# Altium schematic sheet Sheet.SchDoc
size A; SheetNumber: 1; SheetTotal: 1
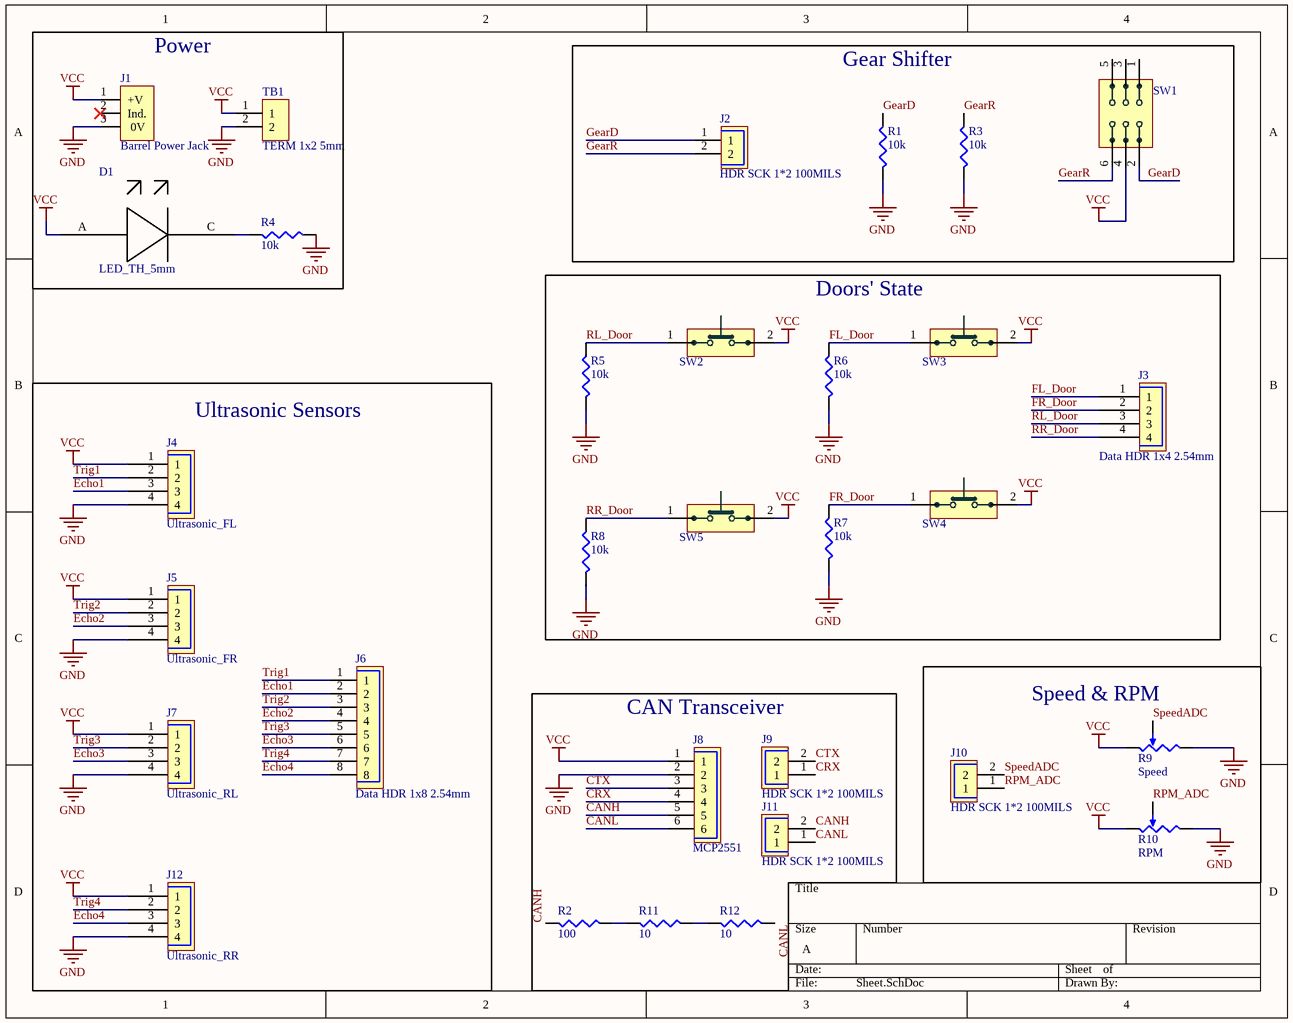
[diagram p0: Sheet.SchDoc]

## Parts
D1  LED_TH_5mm  [LED_TH_5mm]
J1  Barrel Power Jack  [pwr_Jack]
J2  HDR SCK 1*2 100MILS  [DHDR 1*2 2,54MM]
J3  Data HDR 1x4 2.54mm  [DHDR_1x4_2.54mm]
J4  Ultrasonic_FL  [DHDR_1x4_2.54mm]
J5  Ultrasonic_FR  [DHDR_1x4_2.54mm]
J6  Data HDR 1x8 2.54mm  [DHDR_1x8_2.54mm]
J7  Ultrasonic_RL  [DHDR_1x4_2.54mm]
J8  MCP2551  [DHDR_1x6_2.54mm]
J9  HDR SCK 1*2 100MILS  [DHDR 1*2 2,54MM]
J10  HDR SCK 1*2 100MILS  [DHDR 1*2 2,54MM]
J11  HDR SCK 1*2 100MILS  [DHDR 1*2 2,54MM]
J12  Ultrasonic_RR  [DHDR_1x4_2.54mm]
R1  10k  [R_THT_CFR-25]
R2  100  [R_THT_CFR-25]
R3  10k  [R_THT_CFR-25]
R4  10k  [R_THT_CFR-25]
R5  10k  [R_THT_CFR-25]
R6  10k  [R_THT_CFR-25]
R7  10k  [R_THT_CFR-25]
R8  10k  [R_THT_CFR-25]
R9  Speed  [POT]
R10  RPM  [POT]
R11  10  [R_THT_CFR-25]
R12  10  [R_THT_CFR-25]
SW1  1825910-6  [DPDT_6Pin]  (value not drawn)
SW2  1825910-6  [Push_Button_10mm_2Pin]  (value not drawn)
SW3  1825910-6  [Push_Button_10mm_2Pin]  (value not drawn)
SW4  1825910-6  [Push_Button_10mm_2Pin]  (value not drawn)
SW5  1825910-6  [Push_Button_10mm_2Pin]  (value not drawn)
TB1  TERM 1x2 5mm  [Terminal_5mm]

## Blocks framed on the sheet
Power: D1 J1 R4 TB1
Gear Shifter: J2 R1 R3 SW1
Doors' State: J3 R5-R8 SW2-SW5
Ultrasonic Sensors: J4-J7 J12
CAN Transceiver: J8 J9 J11 R2 R11 R12
Speed & RPM: J10 R9 R10

## Nets
GND: J1.3(0V) J4.4 J5.4 J7.4 J8.2 J12.4 R1.1 R3.1 R4.1 R5.1 R6.1 R7.1 R8.1 R9.2 R10.2 TB1.2
VCC: D1.A J1.1(+V) J4.1 J5.1 J7.1 J8.1 J12.1 R9.1 R10.1 SW1.4 SW2.2 SW3.2 SW4.2 SW5.2 TB1.1
CANH: J8.5 J11.2 R2.2
CANL: J8.6 J11.1 R12.1
CRX: J8.4 J9.1
CTX: J8.3 J9.2
Echo1: J4.3 J6.2
Echo2: J5.3 J6.4
Echo3: J6.6 J7.3
Echo4: J6.8 J12.3
FL_Door: J3.1 R6.2 SW3.1
FR_Door: J3.2 R7.2 SW4.1
GearD: J2.1 R1.2 SW1.2
GearR: J2.2 R3.2 SW1.6
RL_Door: J3.3 R5.2 SW2.1
RPM_ADC: J10.1 R10.3
RR_Door: J3.4 R8.2 SW5.1
SpeedADC: J10.2 R9.3
Trig1: J4.2 J6.1
Trig2: J5.2 J6.3
Trig3: J6.5 J7.2
Trig4: J6.7 J12.2
NetD1_C: D1.C R4.2
NetR2_1: R2.1 R11.2
NetR11_1: R11.1 R12.2

Not connected (* = marked no-connect by the designer): J1 2(Ind.)*; SW1 1 3 5

## Library data of the parts
J1 = Con-Jack: DC-Power Socket 12V 5A 2, 1mm Solder Eyel; Manufacturer 1: Cliff; Manufacturer Part Number 1: FC68148; Parameter Name 1: Bulk; Inside Diameter: 6.3mm; Supplier 1: Conrad; RoHS: Yes; Weight: 0.1lb; Current Rating: 5A; Orientation: Right Angle; Connector Type: Socket; Length: 5inch; Height: 0.25inch; Width: 3inch; ComponentLink1URL: http://www.farnell.com/datasheets/317160.pdf?src-supplier=Farnell; ComponentLink1Description: http://www.farnell.com/datasheets/317160.pdf?src-supplier=Farnell; ComponentLink2URL: http://www.rapidonline.com/pdf/735742_da_en_01.pdf?src-supplier=Rapid+Electronics; ComponentLink2Description: http://www.rapidonline.com/pdf/735742_da_en_01.pdf?src-supplier=Rapid+Electronics; ComponentLink3URL: http://www.produktinfo.conrad.com/datenblaetter/725000-749999/735742-da-01-en-DC_BUCHSE_2_1MM_FC68148.pdf?src-supplier=Conrad; ComponentLink3Description: http://www.produktinfo.conrad.com/datenblaetter/725000-749999/735742-da-01-en-DC_BUCHSE_2_1MM_FC68148.pdf?src-supplier=Conrad; Supplier Part Number 1: 735742
J2 J9-J11 = 2-Pin Data Connector: Conn Shrouded Header HDR 2 POS 2.54mm Solder ST Thru-Hole; Manufacturer 1: TE Connectivity; Manufacturer Part Number 1: 2-644861-2; Underplate Material: Nickel; Number of Contacts: 2; Connector Type: Plug,Header,Pin; Voltage Rating: 250V; Mating Alignment: Yes (With); PCB Mount Retention: Without; PCB Mounting Orientation: Vertical; Gender: Male; Current Rating: 5A; Contact Resistance: 6mR; Contact Retention: No (Without); Connector System: Wire-to-Board; Contact Style: Straight; Contact Post Length: 3.56mm; Plating Thickness: 6.3um; PCB Thickness: 0.063inch; Approvals: CSA; Supplier 1: Digi-Key; Stock 1: 3206; Pricing 1: 1=0.41000, 10=0.39200, 100=0.27420, 500=0.23506, 1000=0.19588, 5000=0.16790, 10000=0.15670 (USD); RoHS: Yes; Mount: Through Hole; Housing Color: Black; Contact Plating: Tin,Matte; Contact Material: Copper Alloy; Housing Material: Polyester; Color: Black; Contact Shape: Square; Min Operating Temperature: -67°C; Max Operating Temperature: 221°C; Termination: Solder; Number of Rows: 1; Number of Positions: 2; Package Quantity: 500; Packaging: Bag; Contact Gender: Male; Orientation: Straight; Fastening Type: Friction; Max Voltage Rating (AC): 250V; Shrouded: Yes (With); Voltage Rating (AC): 250V; Mating Retention: Yes (With); PCB Mount Alignment: No (Without); Sealable: No (Without); Contact Current Rating: 5A; Strain Relief: No (Without); Backwall/Post Interruptions: No (Without); Length: 7.21mm; Height: 10.41mm; Pitch: 2.54mm; Contact Mating Length: 5.1mm; Depth: 7.95mm; Tail Length: 3.56mm; Radiation Hardening: No; Flammability Rating: UL94 V-0; ELV: Compliant; Lead Free: Lead Free; REACH SVHC: Unknown; ComponentLink1URL: https://datasheet.ciiva.com/16303/eng-ds-82056-mta-0608-16303634.pdf?src-supplier=Future+Electronics; ComponentLink1Description: https://datasheet.ciiva.com/16303/eng-ds-82056-mta-0608-16303634.pdf?src-supplier=Future+Electronics; ComponentLink2URL: https://datasheet.ciiva.com/30111/8852eng-ds-82056-mta-0608-30111398.pdf?src-supplier=Onlinecomponents.com; ComponentLink2Description: https://datasheet.ciiva.com/30111/8852eng-ds-82056-mta-0608-30111398.pdf?src-supplier=Onlinecomponents.com; ComponentLink3URL: https://datasheet.ciiva.com/709/eng-cd-644861-n-basefilename-709739.pdf?src-supplier=Digi-Key; ComponentLink3Description: https://datasheet.ciiva.com/709/eng-cd-644861-n-basefilename-709739.pdf?src-supplier=Digi-Key; ComponentLink4URL: https://datasheet.ciiva.com/3118/eng-ds-82056-mta-0608-3118126.pdf?src-supplier=Avnet; ComponentLink4Description: https://datasheet.ciiva.com/3118/eng-ds-82056-mta-0608-3118126.pdf?src-supplier=Avnet; Supplier Part Number 1: A30931-ND
J3-J5 J7 J12 = 4-Pin Data Connector: MTA-100 Series, 2.54mm Pitch 4 Way 1 RowStraight PCB Header, Solder Term, 5A; Manufacturer 1: TE Connectivity; Manufacturer Part Number 1: 2-644861-4; Underplate Material: Nickel; Number of Contacts: 4; Connector Type: Plug,Header,Pin; Voltage Rating: 250V; Gender: Male; Shrouded: Yes (With); PCB Mount Retention: Without; PCB Mounting Orientation: Vertical; Contact Resistance: 6mR; Backwall/Post Interruptions: No (Without); Connector System: Wire-to-Board; Contact Post Length: 3.56mm; Plating Thickness: 6.35um; PCB Thickness: 0.063inch; Approvals: CSA; Supplier 1: Digi-Key; Stock 1: 18767; Pricing 1: 1=0.79000, 10=0.74100, 100=0.56790, 500=0.49380, 1000=0.40739, 5000=0.35801, 10000=0.33332 (USD); RoHS: Yes; Mount: Through Hole; Housing Color: Black; Color: Black; Contact Material: Copper Alloy; Contact Plating: Tin,Matte; Housing Material: Polyester; Contact Shape: Square; Min Operating Temperature: -67°C; Max Operating Temperature: 221°C; Termination: Solder; Number of Rows: 1; Contact Gender: Male; Number of Positions: 4; Package Quantity: 500; Packaging: Loose Piece; Current Rating: 5A; Voltage Rating (AC): 250V; Mating Alignment: Yes (With); Orientation: Straight; Fastening Type: Friction; Max Voltage Rating (AC): 250V; Contact Current Rating: 5A; Contact Retention: No (Without); Mating Retention: Yes (With); PCB Mount Alignment: No (Without); Sealable: No (Without); Strain Relief: No (Without); Contact Style: Straight; Length: 12.29mm; Height: 10.41mm; Pitch: 2.54mm; Contact Mating Length: 5.1mm; Depth: 7.95mm; Tail Length: 3.56mm; Radiation Hardening: No; Flammability Rating: UL94 V-0; ELV: Compliant; Lead Free: Lead Free; REACH SVHC: Unknown; ComponentLink1URL: https://datasheet.ciiva.com/7800/1651878-7800290.pdf?src-supplier=Element14; ComponentLink1Description: https://datasheet.ciiva.com/7800/1651878-7800290.pdf?src-supplier=Element14; ComponentLink2URL: https://datasheet.ciiva.com/15175/getdatasheetpartid-36841-15175492.pdf?src-supplier=Verical; ComponentLink2Description: https://datasheet.ciiva.com/15175/getdatasheetpartid-36841-15175492.pdf?src-supplier=Verical; ComponentLink3URL: https://datasheet.ciiva.com/11759/0900766b80f915a0-11759930.pdf?src-supplier=RSComponents; ComponentLink3Description: https://datasheet.ciiva.com/11759/0900766b80f915a0-11759930.pdf?src-supplier=RSComponents; ComponentLink4URL: https://datasheet.ciiva.com/714/eng-cd-644861-n-basefilename-714593.pdf?src-supplier=Digi-Key; ComponentLink4Description: https://datasheet.ciiva.com/714/eng-cd-644861-n-basefilename-714593.pdf?src-supplier=Digi-Key; ComponentLink5URL: https://datasheet.ciiva.com/16684/eng-ds-82056-mta-0608-16684709.pdf?src-supplier=Avnet+Europe; ComponentLink5Description: https://datasheet.ciiva.com/16684/eng-ds-82056-mta-0608-16684709.pdf?src-supplier=Avnet+Europe; ComponentLink6URL: https://datasheet.ciiva.com/16497/eng-ds-82056-mta-0608-16497871.pdf?src-supplier=Avnet+Asia; ComponentLink6Description: https://datasheet.ciiva.com/16497/eng-ds-82056-mta-0608-16497871.pdf?src-supplier=Avnet+Asia; Supplier Part Number 1: A30933-ND
J6 = PinHeader_8Pin: CONN HEADER VERT 8POS .100 TIN; Manufacturer 1: TE Connectivity; Manufacturer Part Number 1: 2-644861-8; Underplate Material: Nickel; Number of Contacts: 8; Connector Type: Plug,Header,Pin; Mating Alignment: Yes (With); PCB Mount Retention: Without; PCB Mounting Orientation: Vertical; Contact Resistance: 6mR; Max Voltage Rating (AC): 250V; Current Rating: 5A; Gender: Male; Backwall/Post Interruptions: No (Without); Connector System: Wire-to-Board; Contact Style: Straight; Contact Post Length: 3.56mm; Plating Thickness: 6.3um; PCB Thickness: 0.063inch; Approvals: CSA; Supplier 1: Digi-Key; Stock 1: 1996; Pricing 1: 1=0.62000, 10=0.58100, 100=0.44530, 500=0.38726, 1000=0.31949, 5000=0.28076, 10000=0.26140 (USD); RoHS: Yes; Mount: Through Hole; Housing Material: Polyester; Contact Shape: Square; Contact Plating: Tin,Matte; Contact Material: Copper Alloy; Color: Black; Housing Color: Black; Min Operating Temperature: -67°C; Max Operating Temperature: 221°C; Termination: Solder; Number of Rows: 1; Number of Positions: 8; Packaging: Bulk; Contact Gender: Male; Package Quantity: 1000; Voltage Rating: 250V; Fastening Type: Friction; Orientation: Straight; Contact Retention: No (Without); Mating Retention: Yes (With); PCB Mount Alignment: No (Without); Sealable: No (Without); Strain Relief: No (Without); Contact Current Rating: 5A; Length: 22.45mm; Height: 10.41mm; Pitch: 2.54mm; Contact Mating Length: 5.1mm; Depth: 7.95mm; Tail Length: 3.56mm; Radiation Hardening: No; Flammability Rating: UL94 V-0; REACH SVHC: Unknown; ComponentLink1URL: https://datasheet.ciiva.com/16303/2-644861-8-16303640.pdf?src-supplier=Future+Electronics; ComponentLink1Description: https://datasheet.ciiva.com/16303/2-644861-8-16303640.pdf?src-supplier=Future+Electronics; ComponentLink2URL: https://datasheet.ciiva.com/11745/0900766b81026688-11745886.pdf?src-supplier=RSComponents; ComponentLink2Description: https://datasheet.ciiva.com/11745/0900766b81026688-11745886.pdf?src-supplier=RSComponents; ComponentLink3URL: https://datasheet.ciiva.com/709/eng-cd-644861-n-basefilename-709773.pdf?src-supplier=Digi-Key; ComponentLink3Description: https://datasheet.ciiva.com/709/eng-cd-644861-n-basefilename-709773.pdf?src-supplier=Digi-Key; ComponentLink4URL: https://datasheet.ciiva.com/9478/eng-ds-82056-mta-0608-9478367.pdf?src-supplier=Avnet; ComponentLink4Description: https://datasheet.ciiva.com/9478/eng-ds-82056-mta-0608-9478367.pdf?src-supplier=Avnet; ComponentLink5URL: https://datasheet.ciiva.com/16684/eng-ds-82056-mta-0608-16684159.pdf?src-supplier=Avnet+Europe; ComponentLink5Description: https://datasheet.ciiva.com/16684/eng-ds-82056-mta-0608-16684159.pdf?src-supplier=Avnet+Europe; Supplier Part Number 1: A30937-ND
J8 = 6-Pin Data Connector: CONN HEADER VERT 6POS .100 TIN; Manufacturer 1: TE Connectivity; Manufacturer Part Number 1: 2-644861-6; Underplate Material: Nickel; Number of Contacts: 6; Connector Type: Plug,Header,Pin; Contact Resistance: 6mR; Mating Alignment: Yes (With); PCB Mount Retention: Without; PCB Mounting Orientation: Vertical; Parameter Name 1: Box; Voltage Rating: 250V; Current Rating: 5A; Backwall/Post Interruptions: No (Without); Connector System: Wire-to-Board; Plating Thickness: 6.3um; Contact Style: Straight; Pitch: 2.54mm; Contact Post Length: 3.56mm; PCB Thickness: 0.063inch; Approvals: CSA; Supplier 1: Digi-Key; Stock 1: 208; Pricing 1: 1=1.04000, 10=0.91900, 100=0.79250, 500=0.64840, 1000=0.57635, 5000=0.50431, 10000=0.47909 (USD); RoHS: Yes; Mount: Through Hole; Housing Material: Polyester; Contact Plating: Tin,Matte; Contact Material: Copper Alloy; Contact Shape: Square; Color: Black; Housing Color: Black; Min Operating Temperature: -67°C; Max Operating Temperature: 221°C; Number of Rows: 1; Termination: Solder; Contact Gender: Male; Package Quantity: 1000; Max Voltage Rating (AC): 250V; Fastening Type: Friction; Orientation: Straight; Number of Positions: 6; Contact Retention: No (Without); Mating Retention: Yes (With); PCB Mount Alignment: No (Without); Sealable: No (Without); Strain Relief: No (Without); Contact Current Rating: 5A; Length: 0.684inch; Height: 10.41mm; Contact Mating Length: 5.1mm; Depth: 7.95mm; Tail Length: 3.56mm; Radiation Hardening: No; Flammability Rating: UL94 V-0; REACH SVHC: Unknown; ComponentLink1URL: https://datasheet.ciiva.com/30493/0900766b80f915a1-30493314.pdf?src-supplier=RSComponents; ComponentLink1Description: https://datasheet.ciiva.com/30493/0900766b80f915a1-30493314.pdf?src-supplier=RSComponents; ComponentLink2URL: https://datasheet.ciiva.com/16303/2-644861-6-16303636.pdf?src-supplier=Future+Electronics; ComponentLink2Description: https://datasheet.ciiva.com/16303/2-644861-6-16303636.pdf?src-supplier=Future+Electronics; ComponentLink3URL: https://datasheet.ciiva.com/16684/eng-ds-82056-mta-0608-16684438.pdf?src-supplier=Avnet+Europe; ComponentLink3Description: https://datasheet.ciiva.com/16684/eng-ds-82056-mta-0608-16684438.pdf?src-supplier=Avnet+Europe; ComponentLink4URL: https://datasheet.ciiva.com/15175/getdatasheetpartid-36761-15175467.pdf?src-supplier=Verical; ComponentLink4Description: https://datasheet.ciiva.com/15175/getdatasheetpartid-36761-15175467.pdf?src-supplier=Verical; ComponentLink5URL: https://datasheet.ciiva.com/714/eng-cd-644861-n-basefilename-714750.pdf?src-supplier=Digi-Key; ComponentLink5Description: https://datasheet.ciiva.com/714/eng-cd-644861-n-basefilename-714750.pdf?src-supplier=Digi-Key; ComponentLink6URL: https://datasheet.ciiva.com/30135/8852eng-ds-82056-mta-0608-30135278.pdf?src-supplier=Onlinecomponents.com; ComponentLink6Description: https://datasheet.ciiva.com/30135/8852eng-ds-82056-mta-0608-30135278.pdf?src-supplier=Onlinecomponents.com; ComponentLink7URL: https://datasheet.ciiva.com/3118/eng-ds-82056-mta-0608-3118127.pdf?src-supplier=Avnet; ComponentLink7Description: https://datasheet.ciiva.com/3118/eng-ds-82056-mta-0608-3118127.pdf?src-supplier=Avnet; Supplier Part Number 1: A30935-ND
R1-R8 R11 R12 = TH CFR-25 Resis: CFR Series 0.25 W 1 KOhm ±5 % -350 to 500 ppm/°C Carbon Film Resistor; Manufacturer 1: Yageo; Manufacturer Part Number 1: CFR-25JB-52-1K; Tolerance: 5%; Resistance: 1kR; Max Power Dissipation: 250mW; Parameter Name 1: Bulk; Supplier 1: Digi-Key; Stock 1: 194074; Pricing 1: 1=0.10000, 25=0.04680, 50=0.03640, 100=0.02600, 250=0.02028, 500=0.01612, 750=0.01379, 1000=0.01144, 2000=0.00988 (USD); RoHS: Yes; Case/Package: Axial; Min Operating Temperature: -55°C; Max Operating Temperature: 155°C; Temperature Coefficient: 500ppm/°C; Resistor Type: Carbon Film; Number of Terminations: 2; Package Quantity: 200; Power Rating: 250mW; Length: 0.248inch; Lead Free: Lead Free; ComponentLink1URL: http://www.yageo.com/NewPortal/yageodocoutput?fileName=/pdf/throughhole/Yageo_LR_CFR_2013.pdf&src-supplier=Digi-Key; ComponentLink1Description: http://www.yageo.com/NewPortal/yageodocoutput?fileName=/pdf/throughhole/Yageo_LR_CFR_2013.pdf&src-supplier=Digi-Key; ComponentLink2URL: http://www.yageo.com/documents/recent/General%20Type_CFR.pdf?src-supplier=Future+Electronics; ComponentLink2Description: http://www.yageo.com/documents/recent/General%20Type_CFR.pdf?src-supplier=Future+Electronics; Supplier Part Number 1: 1.0KQBK-ND
R9 R10 = POT
SW1 = DPDT_6Pin: SWITCH TACTILE SPST-NO 0.05A 24V; Manufacturer 1: TE Connectivity Alcoswitch; Actuator Material: PBT; Mechanical Life: 100000Cycles; Operating Force: 160gf; Throw Configuration: SPST; Illumination Type: Non-Illuminated,Illuminated; Parameter Name 1: Loose Piece; Switch Travel: 0.25mm; Switch Function: Off-Mom; Contact Current Rating: 50mA; Actuator Type: Standard; Contact Resistance: 100mR; Actuator Length: 0.055inch; Supplier 1: Digi-Key; Manufacturer Part Number 1: 1825910-6; Stock 1: 115702; Pricing 1: 1=0.10000, 10=0.10100, 25=0.09560, 100=0.08700, 250=0.08180, 500=0.07484, 1000=0.06265, 5000=0.05743, 10000=0.05395 (USD); RoHS: Yes; Mount: Through Hole; Contact Material: Copper Alloy; Contact Plating: Silver; Min Operating Temperature: -35°C; Max Operating Temperature: 85°C; Termination: PC Pins; Package Quantity: 750; Orientation: Straight; Max Voltage Rating (DC): 24V; Electrical Life: 100000Cycles; Max Current Rating: 50mA; Type: Switch; Length: 5.99mm; REACH SVHC: Unknown; ELV: Compliant; Lead Free: Lead Free; ComponentLink1URL: https://datasheet.ciiva.com/30199/1825910-6rqpn1825910-6-30199520.pdf?src-supplier=Onlinecomponents.com; ComponentLink1Description: https://datasheet.ciiva.com/30199/1825910-6rqpn1825910-6-30199520.pdf?src-supplier=Onlinecomponents.com; ComponentLink2URL: https://datasheet.ciiva.com/15184/getdatasheetpartid-395915-15184509.pdf?src-supplier=Verical; ComponentLink2Description: https://datasheet.ciiva.com/15184/getdatasheetpartid-395915-15184509.pdf?src-supplier=Verical; Supplier Part Number 1: 450-1650-ND
SW2-SW5 = Push_Button_10mm_2Pin: SWITCH TACTILE SPST-NO 0.05A 24V; Manufacturer 1: TE Connectivity Alcoswitch; Actuator Material: PBT; Mechanical Life: 100000Cycles; Operating Force: 160gf; Throw Configuration: SPST; Illumination Type: Non-Illuminated,Illuminated; Parameter Name 1: Loose Piece; Switch Travel: 0.25mm; Switch Function: Off-Mom; Contact Current Rating: 50mA; Actuator Type: Standard; Contact Resistance: 100mR; Actuator Length: 0.055inch; Supplier 1: Digi-Key; Manufacturer Part Number 1: 1825910-6; Stock 1: 115702; Pricing 1: 1=0.10000, 10=0.10100, 25=0.09560, 100=0.08700, 250=0.08180, 500=0.07484, 1000=0.06265, 5000=0.05743, 10000=0.05395 (USD); RoHS: Yes; Mount: Through Hole; Contact Material: Copper Alloy; Contact Plating: Silver; Min Operating Temperature: -35°C; Max Operating Temperature: 85°C; Termination: PC Pins; Package Quantity: 750; Orientation: Straight; Max Voltage Rating (DC): 24V; Electrical Life: 100000Cycles; Max Current Rating: 50mA; Type: Switch; Length: 5.99mm; REACH SVHC: Unknown; ELV: Compliant; Lead Free: Lead Free; ComponentLink1URL: https://datasheet.ciiva.com/30199/1825910-6rqpn1825910-6-30199520.pdf?src-supplier=Onlinecomponents.com; ComponentLink1Description: https://datasheet.ciiva.com/30199/1825910-6rqpn1825910-6-30199520.pdf?src-supplier=Onlinecomponents.com; ComponentLink2URL: https://datasheet.ciiva.com/15184/getdatasheetpartid-395915-15184509.pdf?src-supplier=Verical; ComponentLink2Description: https://datasheet.ciiva.com/15184/getdatasheetpartid-395915-15184509.pdf?src-supplier=Verical; Supplier Part Number 1: 450-1650-ND
TB1 = Terminal BLK Green: PHOENIX CONTACT         MKDSN 1,5/ 2             Wire-To-Board Terminal Block, 5 mm, 2 Ways, 26 AWG, 16 AWG, 1.5 mm, Screw; Manufacturer Part Number 1: 1729018; Parameter Name 1: Bulk; Number of Positions: 2; Current Rating: 13.5A; Number of Levels: 1; Current: 10A; Gender: Male; Voltage Rating: 400V; Voltage: 300V; Max Supply Voltage: 250V; Wire Gauge (Max): 26AWG; Stripping Length: 6mm; Approvals: UL,CSA,cULus,CB; Supplier 1: Mouser; Manufacturer 1: Phoenix Contact; Stock 1: 6371; Pricing 1: 1=1.10000, 10=1.05000, 50=1.01000, 100=0.97400, 250=0.91000, 500=0.83800 (USD); RoHS: Yes; Mount: Through Hole; Number of Pins: 2; Weight: 0.06949oz; Color: Green; Material: Polyamide; Housing Material: Polyamide; Housing Color: Green; Contact Material: Tin; Insulation Material: Nylon; Package Quantity: 50; Termination: Screw; Number of Positions Per Level: 2; Number of Contacts: 2; Number of Circuits: 2; Connector Type: Screw; Orientation: Straight; Number of Rows: 1; Max Current Rating: 13.5A; Number of Poles: 2; Length: 8.1mm; Height: 13.5mm; Pitch: 5mm; Wire Gauge (Min): 26AWG; Depth: 8.1mm; Width: 13.5mm; Wire/Cable Gauge: 26AWG; Radiation Hardening: No; REACH SVHC: Unknown; Flammability Rating: UL94 V-0; Lead Free: Lead Free; ComponentLink1URL: https://datasheet.ciiva.com/16071/1729018-16071814.pdf?src-supplier=Onlinecomponents.com; ComponentLink1Description: https://datasheet.ciiva.com/16071/1729018-16071814.pdf?src-supplier=Onlinecomponents.com; ComponentLink2URL: https://datasheet.ciiva.com/832/1729018-832055.pdf?src-supplier=Digi-Key; ComponentLink2Description: https://datasheet.ciiva.com/832/1729018-832055.pdf?src-supplier=Digi-Key; ComponentLink3URL: https://datasheet.ciiva.com/15169/getdatasheetpartid-177860-15169643.pdf?src-supplier=Verical; ComponentLink3Description: https://datasheet.ciiva.com/15169/getdatasheetpartid-177860-15169643.pdf?src-supplier=Verical; ComponentLink4URL: https://datasheet.ciiva.com/14607/70054375-14607356.pdf?src-supplier=Allied+Electronics; ComponentLink4Description: https://datasheet.ciiva.com/14607/70054375-14607356.pdf?src-supplier=Allied+Electronics; ComponentLink5URL: https://datasheet.ciiva.com/33105/1729018-33105978.pdf?src-supplier=Today+Components; ComponentLink5Description: https://datasheet.ciiva.com/33105/1729018-33105978.pdf?src-supplier=Today+Components; Supplier Part Number 1: 651-1729018